# EAGLE design Relay Module v1.3 (EAGLE 7.2.0)
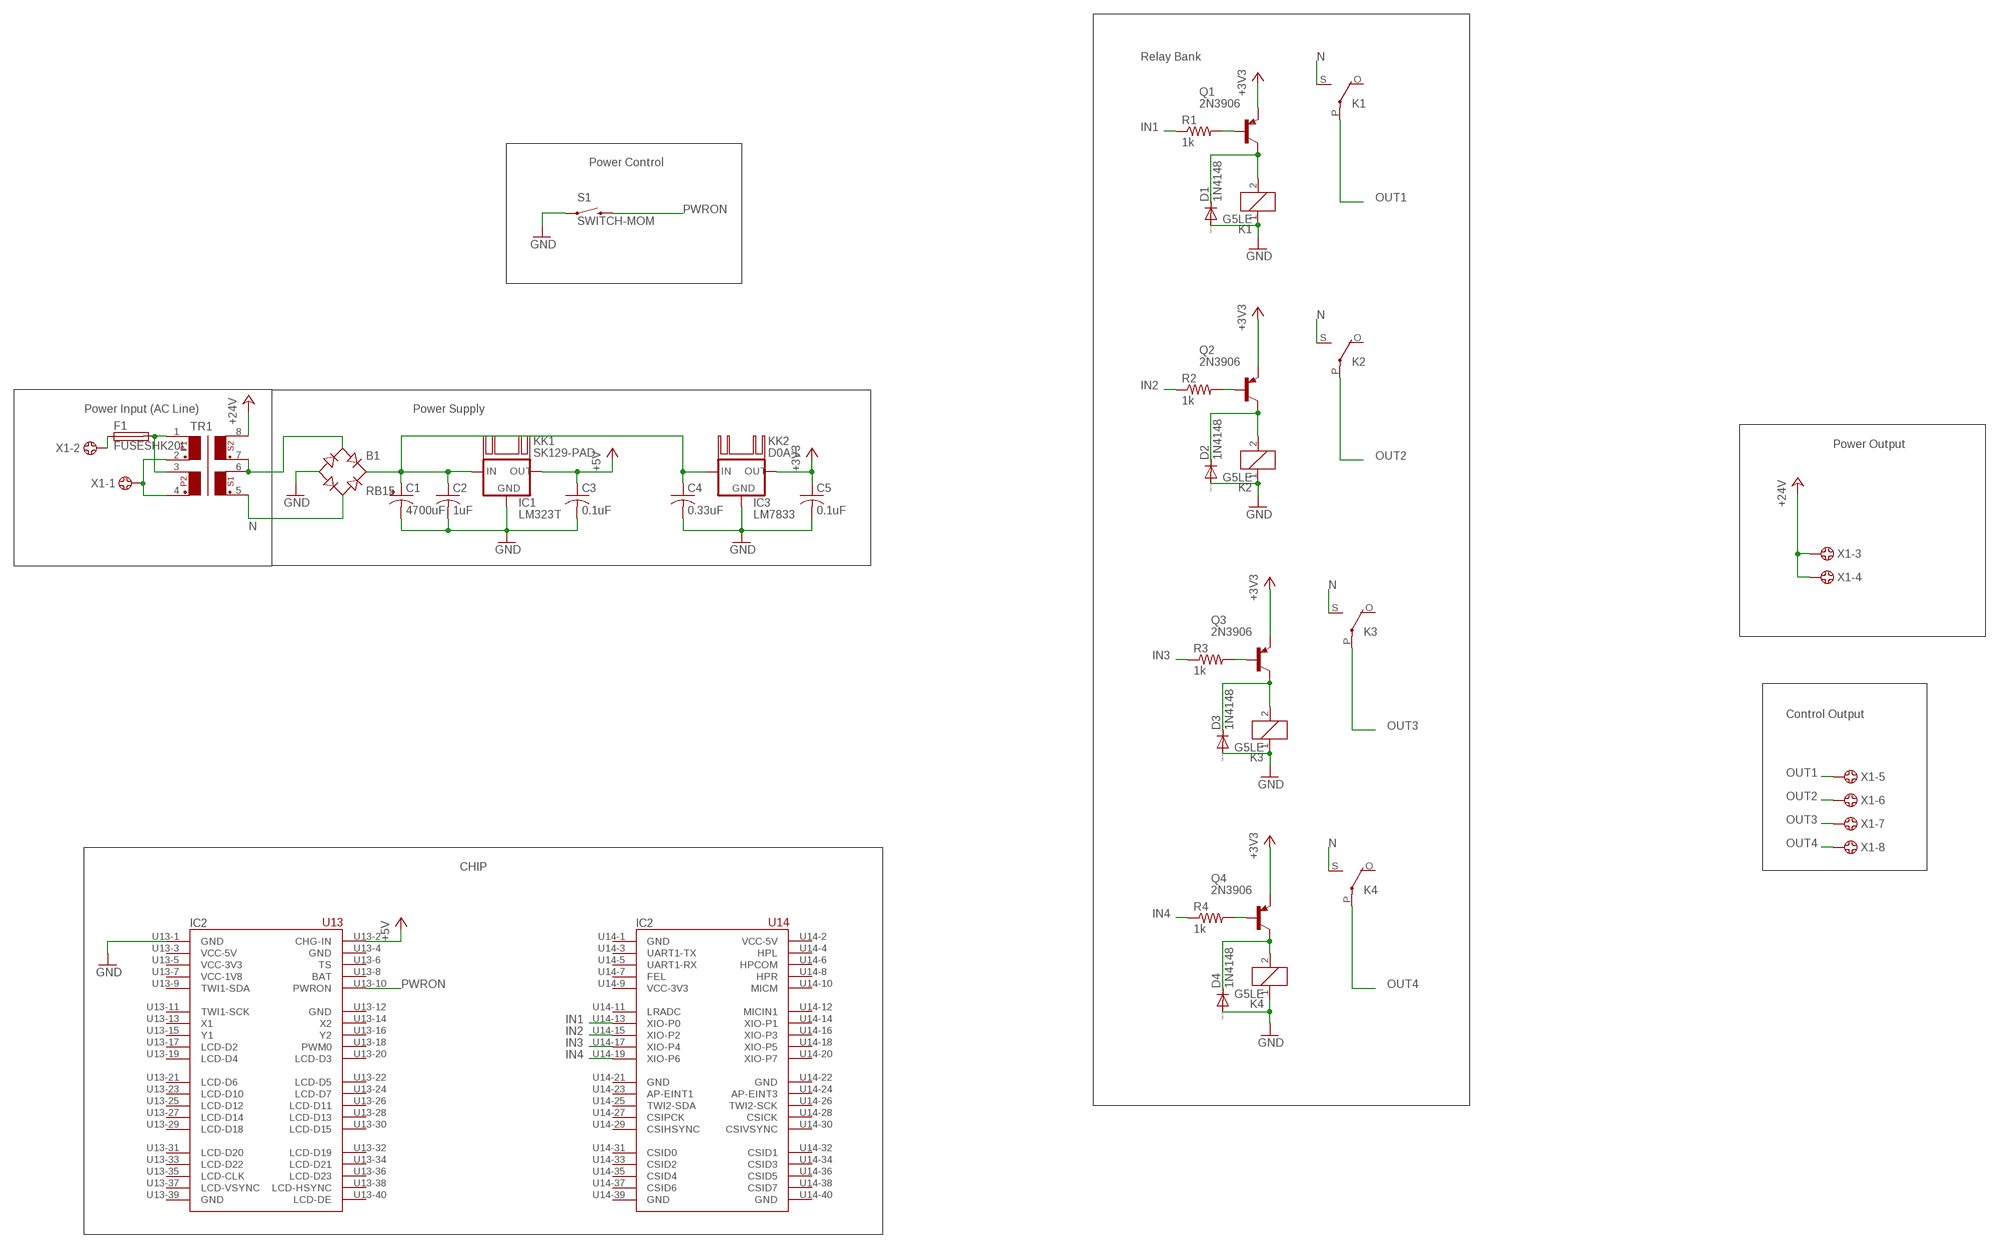
[diagram p0: schematic, sheet 1]

## Parts
B1  RB15  RECTIFIER-RB15  [RB15]
C1  4700uF  CPOL-USE7.5-18  [E7,5-18]
C2  1uF  C-US025-025X050  [C025-025X050]
C3  0.1uF  C-US025-025X050  [C025-025X050]
C4  0.33uF  C-US025-025X050  [C025-025X050]
C5  0.1uF  C-US025-025X050  [C025-025X050]
D1  1N4148  1N4148DO35-7  [DO35-7]
D2  1N4148  1N4148DO35-7  [DO35-7]
D3  1N4148  1N4148DO35-7  [DO35-7]
D4  1N4148  1N4148DO35-7  [DO35-7]
F1  FUSESHK20L  [SHK20L]
IC1  LM323T  LM323-TO3  [TO220S]
IC2  C_H_I_P-1_0  [C_H_I_P-1_0]
IC3  LM7833  78XXL  [78XXL]
K1  G5LE  [G5LE]
K2  G5LE  [G5LE]
K3  G5LE  [G5LE]
K4  G5LE  [G5LE]
KK1  SK129-PAD  [SK129]
KK2  D0A-L  [D02A-L]
Q1  2N3906  [TO92]
Q2  2N3906  [TO92]
Q3  2N3906  [TO92]
Q4  2N3906  [TO92]
R1  1k  R-US_0207/10  [0207/10]
R2  1k  R-US_0207/10  [0207/10]
R3  1k  R-US_0207/10  [0207/10]
R4  1k  R-US_0207/10  [0207/10]
S1  SWITCH-MOM  SWITCH-MOMENTARY-2PTH  [TACTILE-PTH]
TR1  FS24-1500-C2  [FS24-1500-C2]
X1  5202-08-N-02  [5202-08-N-02]

## Nets
+3V3 [power]: C5.1 IC3.OUT Q1.3(E) Q2.3(E) Q3.3(E) Q4.3(E)
+5V [power]: C3.1 IC1.3(OUT) IC2.U13-2(CHG-IN)
+24V [power]: TR1.8 X1.3 X1.4
GND [power]: B1.- C1.- C2.2 C3.2 C4.2 C5.2 D1.A D2.A D3.A D4.A IC1.2(GND) IC2.U13-1(GND) IC3.GND K1.1 K2.1 K3.1 K4.1 S1.1
IN1: IC2.U14-13(XIO-P0) R1.1
IN2: IC2.U14-15(XIO-P2) R2.1
IN3: IC2.U14-17(XIO-P4) R3.1
IN4: IC2.U14-19(XIO-P6) R4.1
N [power]: B1.AC2 K1.S(2:S) K2.S(2:S) K3.S(2:S) K4.S(2:S) TR1.5
N$1 [power]: B1.+ C1.+ C2.1 C4.1 IC1.1(IN) IC3.IN
N$2: Q1.2(B) R1.2
N$3: F1.2A TR1.1 TR1.3
N$5 [power]: D1.C K1.2 Q1.1(C)
N$7: F1.1A X1.2
N$9 [power]: B1.AC1 TR1.6 TR1.7
N$10: TR1.2 TR1.4 X1.1
N$11 [power]: D2.C K2.2 Q2.1(C)
N$12 [power]: D3.C K3.2 Q3.1(C)
N$13 [power]: D4.C K4.2 Q4.1(C)
N$14: Q2.2(B) R2.2
N$15: Q3.2(B) R3.2
N$16: Q4.2(B) R4.2
OUT1 [power]: K1.P(2:P) X1.5
OUT2 [power]: K2.P(2:P) X1.6
OUT3 [power]: K3.P(2:P) X1.7
OUT4 [power]: K4.P(2:P) X1.8
PWRON: IC2.U13-10(PWRON) S1.3
Unconnected: IC2.U13-3(VCC-5V) IC2.U13-5(VCC-3V3) IC2.U13-6(TS) IC2.U13-7(VCC-1V8) IC2.U13-9(TWI1-SDA) IC2.U13-11(TWI1-SCK) IC2.U13-13(X1) IC2.U13-14(X2) IC2.U13-15(Y1) IC2.U13-16(Y2) IC2.U13-17(LCD-D2) IC2.U13-18(PWM0) IC2.U13-19(LCD-D4) IC2.U13-20(LCD-D3) IC2.U13-21(LCD-D6) IC2.U13-22(LCD-D5) IC2.U13-23(LCD-D10) IC2.U13-24(LCD-D7) IC2.U13-25(LCD-D12) IC2.U13-26(LCD-D11) IC2.U13-27(LCD-D14) IC2.U13-28(LCD-D13) IC2.U13-29(LCD-D18) IC2.U13-30(LCD-D15) IC2.U13-31(LCD-D20) IC2.U13-32(LCD-D19) IC2.U13-33(LCD-D22) IC2.U13-34(LCD-D21) IC2.U13-35(LCD-CLK) IC2.U13-36(LCD-D23) IC2.U13-37(LCD-VSYNC) IC2.U13-38(LCD-HSYNC) IC2.U13-40(LCD-DE) IC2.U14-2(VCC-5V) IC2.U14-3(UART1-TX) IC2.U14-4(HPL) IC2.U14-5(UART1-RX) IC2.U14-6(HPCOM) IC2.U14-7(FEL) IC2.U14-8(HPR) IC2.U14-9(VCC-3V3) IC2.U14-10(MICM) IC2.U14-11(LRADC) IC2.U14-12(MICIN1) IC2.U14-14(XIO-P1) IC2.U14-16(XIO-P3) IC2.U14-18(XIO-P5) IC2.U14-20(XIO-P7) IC2.U14-23(AP-EINT1) IC2.U14-24(AP-EINT3) IC2.U14-25(TWI2-SDA) IC2.U14-26(TWI2-SCK) IC2.U14-27(CSIPCK) IC2.U14-28(CSICK) IC2.U14-29(CSIHSYNC) IC2.U14-30(CSIVSYNC) IC2.U14-31(CSID0) IC2.U14-32(CSID1) IC2.U14-33(CSID2) IC2.U14-34(CSID3) IC2.U14-35(CSID4) IC2.U14-36(CSID5) IC2.U14-37(CSID6) IC2.U14-38(CSID7) K1.O(2:O) K2.O(2:O) K3.O(2:O) K4.O(2:O) KK1.A2,5(K) KK1.B2,5(K)

## Notes on the sheet
- Relay Bank
- Power Control
- Power Input (AC Line) | Power Supply
- Power Output
- Control Output
- CHIP

## Power pins joined to a net without a drawn wire
BAT: IC2.U13-8(BAT)
GND: IC2.U13-4(GND) IC2.U13-12(GND) IC2.U13-39(GND) IC2.U14-1(GND) IC2.U14-21(GND) IC2.U14-22(GND) IC2.U14-39(GND) IC2.U14-40(GND)

## Library data of the parts
B1 = rectifier:RECTIFIER-: Rectifier
C1 = rcl:CPOL-US: POLARIZED CAPACITOR, American symbol
C2-C5 = rcl:C-US: CAPACITOR, American symbol
D1-D4 = diode:1N4148: DIODE high speed (Philips)
F1 = fuse:FUSE: Fuse; OC_FARNELL: unknown; OC_NEWARK: unknown
IC1 = v-reg:LM323-TO3: VOLTAGE REGULATOR
IC2 = SENG:C_H_I_P-1_0: C.H.I.P. 1.0 Linux computer module with on chip power management unit
IC3 = v-reg:78XXL: VOLTAGE REGULATOR
K1-K4 = relay:G5LE: RELAY 1 x switch, 10 A/120 V AC, 8 A/30 V DC, Omron; OC_FARNELL: unknown; OC_NEWARK: unknown
KK1 = heatsink:SK129-PAD: HEATSINK manufacturer Fischer/distributor Buerklin
KK2 = heatsink:D0A-L: HEATSINK distributor Schukat
Q1-Q4 = transistor-pnp:2N3906: PNP Transistor
R1-R4 = rcl:R-US_: RESISTOR, American symbol
S1 = SparkFun-Electromechanical:SWITCH-MOMENTARY-2: Various NO switches- pushbuttons, reed, etc; PROD_ID: SWCH-08441
TR1 = trafo:FS24-1500-C2: TRANSFORMER 2 primary winding, 2 secondary windings, mounting holes ERA
X1 = con-ebyelectro:5202-08-N-02

## Net classes
0 default: width 0.508 mm, clearance 0.254 mm
1 power: width 1.27 mm, clearance 0.254 mm

## Board
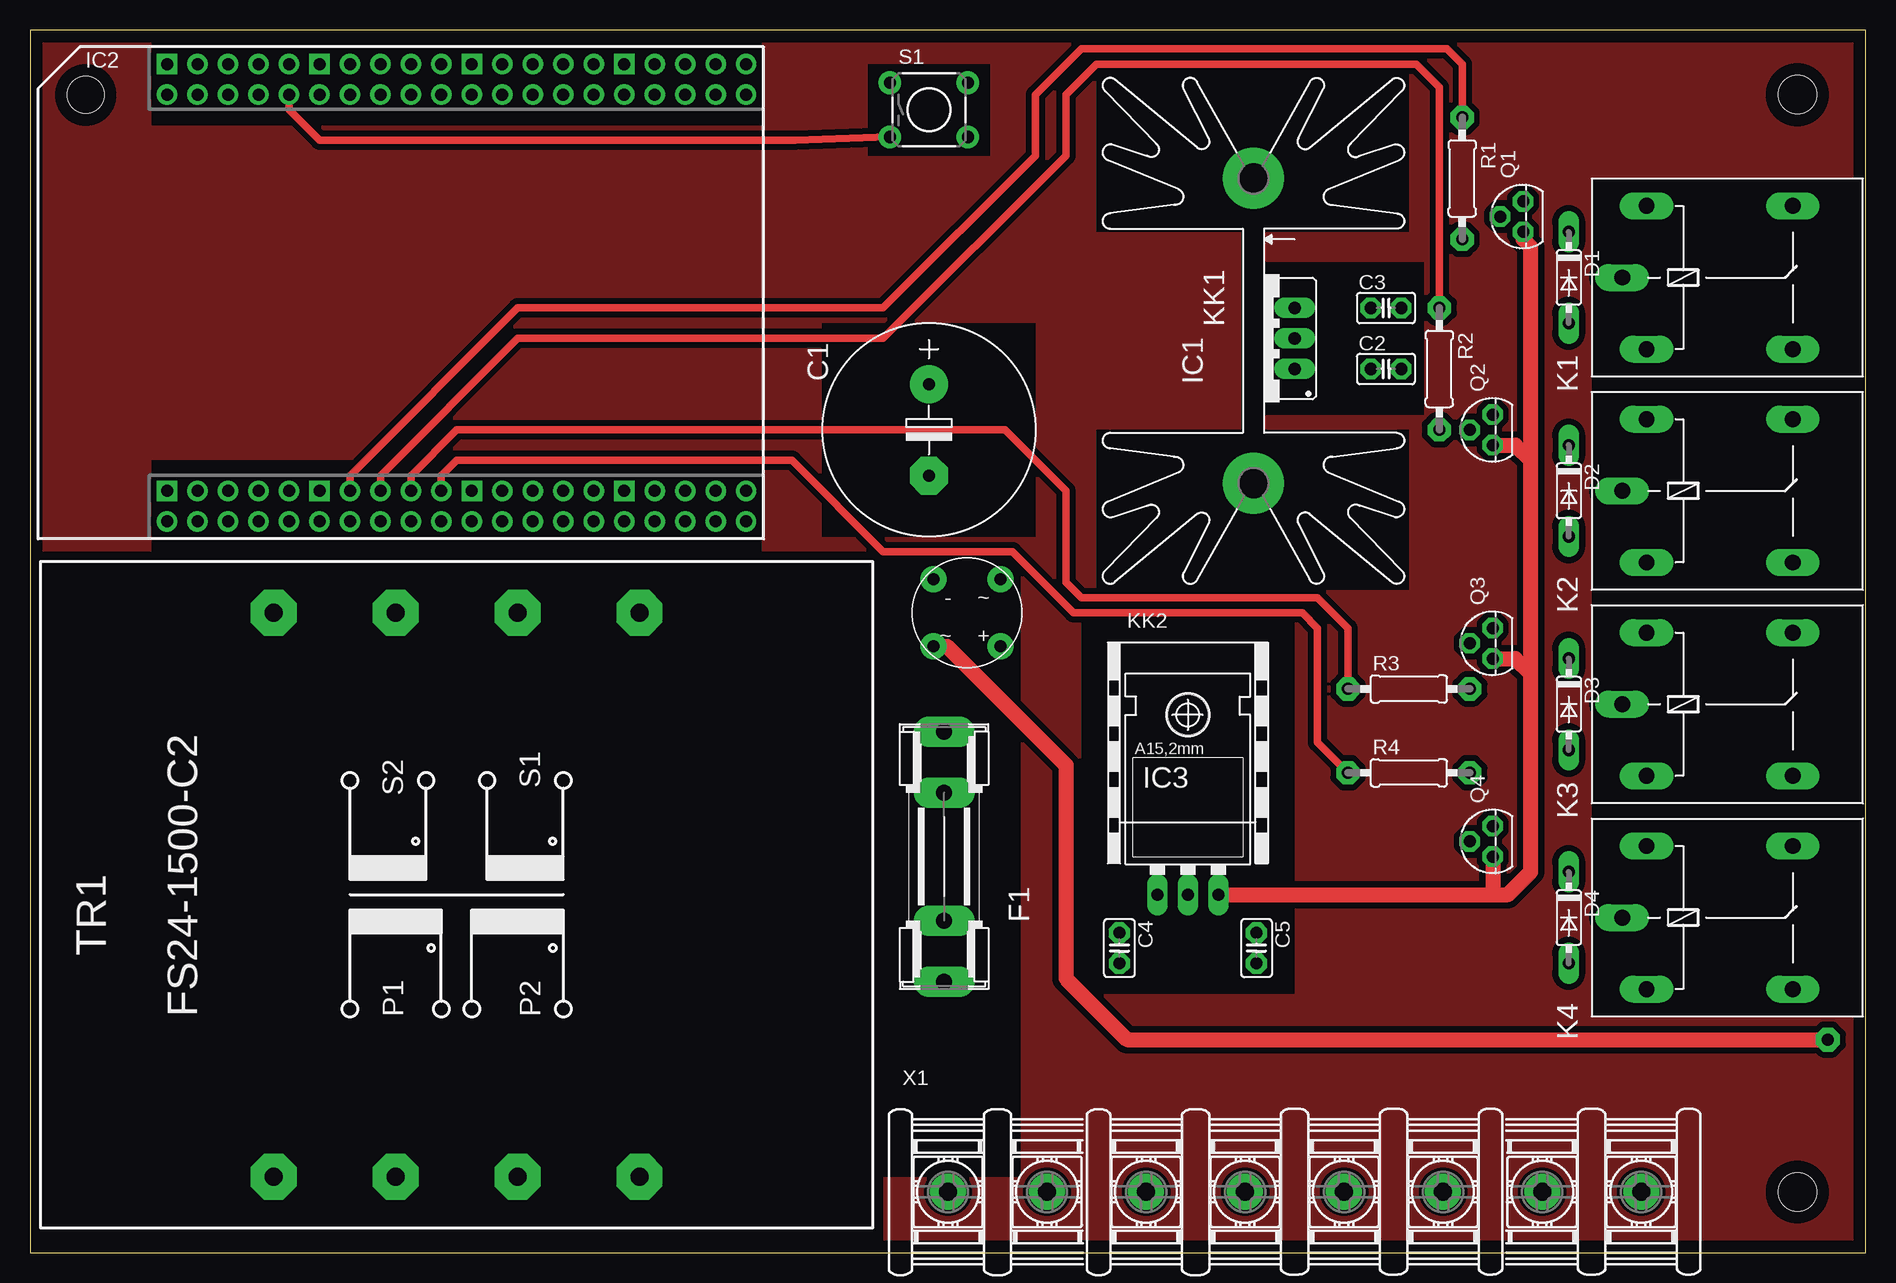
[diagram p1: board, top side]
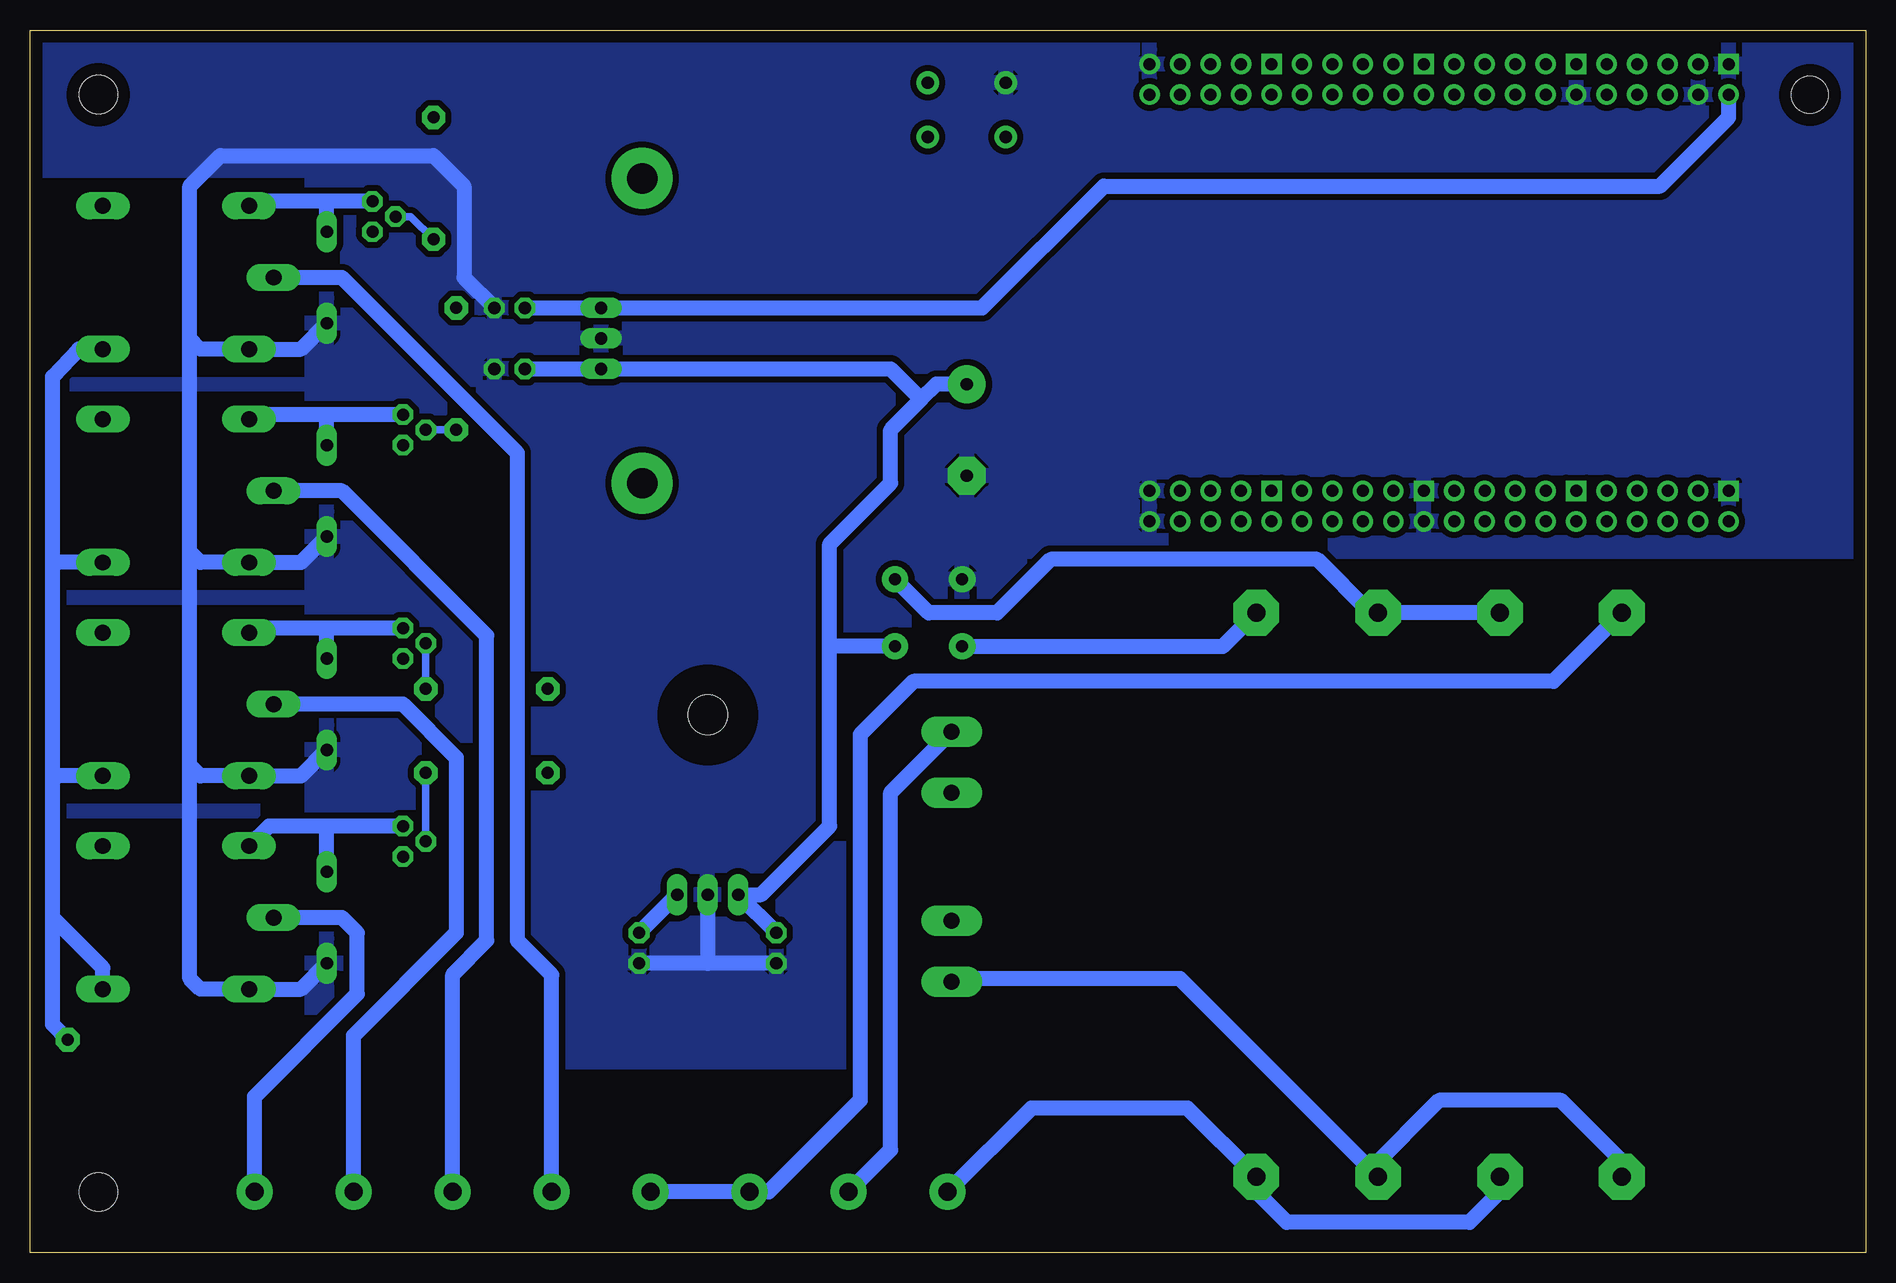
[diagram p2: board, bottom side, seen from below]

Size 153.01 x 101.91 mm. Coordinates in mm from the lower left corner, seen from the top.
Outline: 0,0 153.01,0 153.01,101.91 0,101.91 0,0
Copper layers (1*16): Top 0.035mm / dielectric 1.5mm / Bottom 0.035mm
Design rules "HomeFab": minimum track width 24mil, minimum drill 39mil, track to track 20mil, track to pad 20mil, pad to pad 20mil, via to via 20mil, smd to smd 8mil, copper to edge 40mil, drill to drill 8mil, minimum pad ring 10mil, minimum via ring 8mil, stop-mask expansion 4mil, vias tented up to drill 0mil, thermal gap 10mil
Holes 3.2 mm at 147.32,96.52 147.32,5.08
tRestrict: area 69.8,91.4 to 80,99.1; area 102.9,69.8 to 116.2,82.5; area 70.5,6.3 to 82.5,57.8; area 66,59.7 to 83.8,77.5; area 87.6,21.6 to 105.4,52.7; area 0,0 to 71.1,58.4; area 10.2,58.4 to 61,66; area 10.2,94 to 61,101.6; area 130.2,19.7 to 153,89.5
bRestrict: area 83.8,0 to 152.4,15.2

### Footprints (pad centres in the part's own frame; a part is rotated, then mirrored left to right if it is on the bottom)
RB15 = drill 1 pad 2.184: + -2.794,2.794; - 2.794,-2.794; AC1 -2.794,-2.794; AC2 2.794,2.794
E7,5-18 = drill 1.016 pad 3.15: + -3.81,0 | drill 1.016 pad 3.15 octagon: - 3.81,0
C025-025X050 = drill 1.016 pad 1.676 octagon: 1 -1.27,0; 2 1.27,0
DO35-7 = drill 1.016 long: A 3.81,0; C -3.81,0
SHK20L = drill 1.321 pad 2.54 long: 1A -10.414,0; 1B -5.334,0; 2A 10.414,0; 2B 5.334,0
TO220S = drill 1.016 long: 1 -2.54,-2.54; 2 0,-2.54; 3 2.54,-2.54
C_H_I_P-1_0 = drill 1 square: U13-1 0,0; U13-11 -12.7,0; U13-21 -25.4,0; U13-31 -38.1,0; U14-1 0,35.56; U14-11 -12.7,35.56; U14-21 -25.4,35.56; U14-31 -38.1,35.56 | drill 1: U13-2 0,2.54; U13-3 -2.54,0; U13-4 -2.54,2.54; U13-5 -5.08,0; U13-6 -5.08,2.54; U13-7 -7.62,0; U13-8 -7.62,2.54; U13-9 -10.16,0; U13-10 -10.16,2.54; U13-12 -12.7,2.54; U13-13 -15.24,0; U13-14 -15.24,2.54; U13-15 -17.78,0; U13-16 -17.78,2.54; U13-17 -20.32,0; U13-18 -20.32,2.54; U13-19 -22.86,0; U13-20 -22.86,2.54; U13-22 -25.4,2.54; U13-23 -27.94,0; U13-24 -27.94,2.54; U13-25 -30.48,0; U13-26 -30.48,2.54; U13-27 -33.02,0; U13-28 -33.02,2.54; U13-29 -35.56,0; U13-30 -35.56,2.54; U13-32 -38.1,2.54; U13-33 -40.64,0; U13-34 -40.64,2.54; U13-35 -43.18,0; U13-36 -43.18,2.54; U13-37 -45.72,0; U13-38 -45.72,2.54; U13-39 -48.26,0; U13-40 -48.26,2.54; U14-2 0,38.1; U14-3 -2.54,35.56; U14-4 -2.54,38.1; U14-5 -5.08,35.56; U14-6 -5.08,38.1; U14-7 -7.62,35.56; U14-8 -7.62,38.1; U14-9 -10.16,35.56; U14-10 -10.16,38.1; U14-12 -12.7,38.1; U14-13 -15.24,35.56; U14-14 -15.24,38.1; U14-15 -17.78,35.56; U14-16 -17.78,38.1; U14-17 -20.32,35.56; U14-18 -20.32,38.1; U14-19 -22.86,35.56; U14-20 -22.86,38.1; U14-22 -25.4,38.1; U14-23 -27.94,35.56; U14-24 -27.94,38.1; U14-25 -30.48,35.56; U14-26 -30.48,38.1; U14-27 -33.02,35.56; U14-28 -33.02,38.1; U14-29 -35.56,35.56; U14-30 -35.56,38.1; U14-32 -38.1,38.1; U14-33 -40.64,35.56; U14-34 -40.64,38.1; U14-35 -43.18,35.56; U14-36 -43.18,38.1; U14-37 -45.72,35.56; U14-38 -45.72,38.1; U14-39 -48.26,35.56; U14-40 -48.26,38.1 | hole 3.08: 6.78,2.56
78XXL = drill 1.016 long: GND 0,-3.81; IN -2.54,-3.81; OUT 2.54,-3.81 | hole 3.302: 0,11.176
G5LE = drill 1.321 long: 1 -7.493,-5.969; 2 -7.493,5.969; O 4.699,5.969; P -9.525,0; S 4.699,-5.969
SK129 = drill 2.54 pad 5.08: A2,5 -12.7,-0.889; B2,5 12.7,-0.889
TO92 = drill 1 octagon: 1 1.27,0; 2 0,1.905; 3 -1.27,0
0207/10 = drill 1 pad 1.93 octagon: 1 -5.08,0; 2 5.08,0
TACTILE-PTH = drill 1.016 pad 1.88: 1 -3.251,2.261; 2 3.251,2.261; 3 -3.251,-2.261; 4 3.251,-2.261
FS24-1500-C2 = drill 1.5 pad 3.81 octagon: 1 -23.495,15.24; 2 -23.495,5.08; 3 -23.495,-5.08; 4 -23.495,-15.24; 5 23.495,-15.24; 6 23.495,-5.08; 7 23.495,5.08; 8 23.495,15.24
5202-08-N-02 = drill 1.5 pad 3: 1 -28.885,0; 2 -20.635,0; 3 -12.375,0; 4 -4.125,0; 5 4.125,0; 6 12.375,0; 7 20.635,0; 8 28.885,0

### Placement (x,y rotation side)
B1  78.11,53.34 180 top
C1  74.93,68.58 270 top
C2  113.03,73.66 0 top
C3  113.03,78.74 0 top
C4  90.81,25.4 270 top
C5  102.23,25.4 270 top
D1  128.27,81.28 270 top
D2  128.27,63.5 270 top
D3  128.27,45.72 270 top
D4  128.27,27.94 270 top
F1  76.2,33.02 270 top
IC1  102.87,76.2 90 top
IC2  11.43,99.06 180 top
IC3  96.52,33.66 0 top
K1  142.24,81.28 0 top
K2  142.24,63.5 0 top
K3  142.24,45.72 0 top
K4  142.24,27.94 0 top
KK1  102.87,76.83 270 top
KK2  96.52,39.37 270 top
Q1  124.46,86.36 90 top
Q2  121.92,68.58 90 top
Q3  121.92,50.8 90 top
Q4  121.92,34.29 90 top
R1  119.38,89.53 270 top
R2  117.47,73.66 270 top
R3  114.94,46.99 0 top
R4  114.94,40.01 0 top
S1  74.93,95.25 0 top
TR1  35.56,29.84 90 top
X1  105.41,5.08 0 top

### Tracks (layer width: path | path; a pad name or v marks a point on that pad's centre or on a via)
+3V3
  Top 1.27: IC3.OUT 121.92,29.84 | 121.92,29.84 123.19,29.84 125.09,31.75 125.09,48.26 | 125.09,48.26 125.09,66.04 | 125.09,66.04 125.09,83.82 124.46,84.45 Q1.3 | Q4.3 121.92,29.84 | Q2.3 123.83,67.31 125.09,66.04 | Q3.3 123.83,49.53 125.09,48.26
  Bottom 1.27: IC3.OUT C5.1
+5V
  Bottom 1.27: IC2.U13-2 11.43,94.61 17.14,88.9 63.5,88.9 73.66,78.74 IC1.3 C3.1
+24V
  Bottom 1.27: TR1.8 26.04,47.62 79.38,47.62 83.82,43.18 83.82,12.7 91.44,5.08 X1.3 X1.4
GND
  Bottom 1.27: C4.2 96.52,24.13 | 96.52,24.13 C5.2 | IC3.GND 96.52,24.13 | 139.7,40.64 139.7,22.86 138.81,21.97 K4.1 130.43,21.97 D4.A | 139.7,40.64 139.7,58.42 | 139.7,58.42 139.7,76.2 | 139.7,76.2 139.7,88.9 137.16,91.44 119.38,91.44 116.84,88.9 116.84,81.28 C3.2 | 139.7,76.2 138.81,75.31 K1.1 130.43,75.31 D1.A | 139.7,58.42 138.81,57.53 K2.1 130.43,57.53 D2.A | 139.7,40.64 138.81,39.75 K3.1 130.43,39.75 D3.A
  pour Bottom: 0,0 152.4,0 152.4,101.6 0,101.6
IN1
  Top 0.61: IC2.U14-13 26.67,64.77 40.64,78.74 71.12,78.74 83.82,91.44 83.82,96.52 87.63,100.33 118.11,100.33 119.38,99.06 R1.1
IN2
  Top 0.61: IC2.U14-15 29.21,64.77 40.64,76.2 71.12,76.2 86.36,91.44 86.36,96.52 88.9,99.06 115.57,99.06 117.47,97.16 R2.1
IN3
  Top 0.61: IC2.U14-17 31.75,64.77 35.56,68.58 81.28,68.58 86.36,63.5 86.36,55.88 87.63,54.61 107.31,54.61 109.86,52.07 R3.1
IN4
  Top 0.61: IC2.U14-19 34.29,64.77 35.56,66.04 63.5,66.04 71.12,58.42 81.92,58.42 87,53.34 106.05,53.34 107.31,52.07 107.31,42.55 R4.1
N  (via drill 1 pad 1.68)
  Top 1.27: B1.AC2 76.45,50.55 86.36,40.64 86.36,22.86 91.44,17.78 v149.86,17.78
  Bottom 1.27: K4.S 146.94,23.75 151.13,27.94 | 151.13,27.94 151.13,39.37 | 151.13,39.37 151.13,57.15 | 151.13,57.15 151.13,73.03 148.97,75.31 K1.S | K2.S 150.75,57.53 151.13,57.15 | K3.S 150.75,39.75 151.13,39.37 | B1.AC2 53.59,50.55 TR1.5 | v149.86,17.78 151.13,19.05 151.13,27.94
N$1
  Bottom 1.27: C4.1 IC3.IN 92.08,29.84 86.36,35.56 86.36,50.8 | C1.+ 77.47,72.39 78.74,71.12 | 78.74,71.12 81.28,68.58 81.28,64.14 86.36,59.05 86.36,50.8 | B1.+ 86.11,50.55 86.36,50.8 | C2.1 IC1.1 81.28,73.66 78.74,71.12
N$2
  Bottom 0.61: Q1.2 121.28,86.36 R1.2
N$3
  Bottom 1.27: 41.27,6.99 57.15,22.86 75.95,22.86 F1.2A | 41.27,6.99 TR1.3 | TR1.1 20.32,7.62 25.4,12.7 35.56,12.7 41.27,6.99
N$5
  Bottom 1.27: Q1.1 128.27,87.63 | 128.27,87.63 134.37,87.63 K1.2 | D1.C 128.27,87.63
N$7
  Bottom 1.27: F1.1A 81.28,38.35 81.28,8.57 X1.2
N$9
  Bottom 1.27: TR1.7 TR1.6 41.27,53.34 45.72,57.78 67.94,57.78 72.39,53.34 78.11,53.34 B1.AC1
N$10
  Bottom 1.27: TR1.2 30.48,5.08 33.02,2.54 48.26,2.54 50.8,5.08 TR1.4 56.52,12.06 69.54,12.06 X1.1
N$11
  Bottom 1.27: Q2.1 128.27,69.85 | 128.27,69.85 134.37,69.85 K2.2 | D2.C 128.27,69.85
N$12
  Bottom 1.27: Q3.1 128.27,52.07 | 128.27,52.07 134.37,52.07 K3.2 | D3.C 128.27,52.07
N$13
  Bottom 1.27: Q4.1 128.27,35.56 | 128.27,35.56 133.1,35.56 K4.2 | D4.C 128.27,35.56
N$14
  Bottom 0.61: Q2.2 R2.2
N$15
  Bottom 0.61: R3.2 Q3.2
N$16
  Bottom 0.61: Q4.2 R4.2
OUT1
  Bottom 1.27: K1.P 127,81.28 112.39,66.67 112.39,26.04 109.53,23.18 X1.5
OUT2
  Bottom 1.27: K2.P 127,63.5 114.94,51.44 114.94,26.04 117.78,23.18 X1.6
OUT3
  Bottom 1.27: K3.P 121.92,45.72 117.47,41.27 117.47,26.67 126.05,18.1 X1.7
OUT4
  Bottom 1.27: K4.P 127,27.94 125.73,26.67 125.73,21.59 134.29,13.03 X1.8
PWRON
  Top 0.61: S1.3 63.78,92.71 24.13,92.71 21.59,95.25 IC2.U13-10
TOPPOUR
  pour Top: 0,101.6 152.4,101.6 152.4,0 0,0